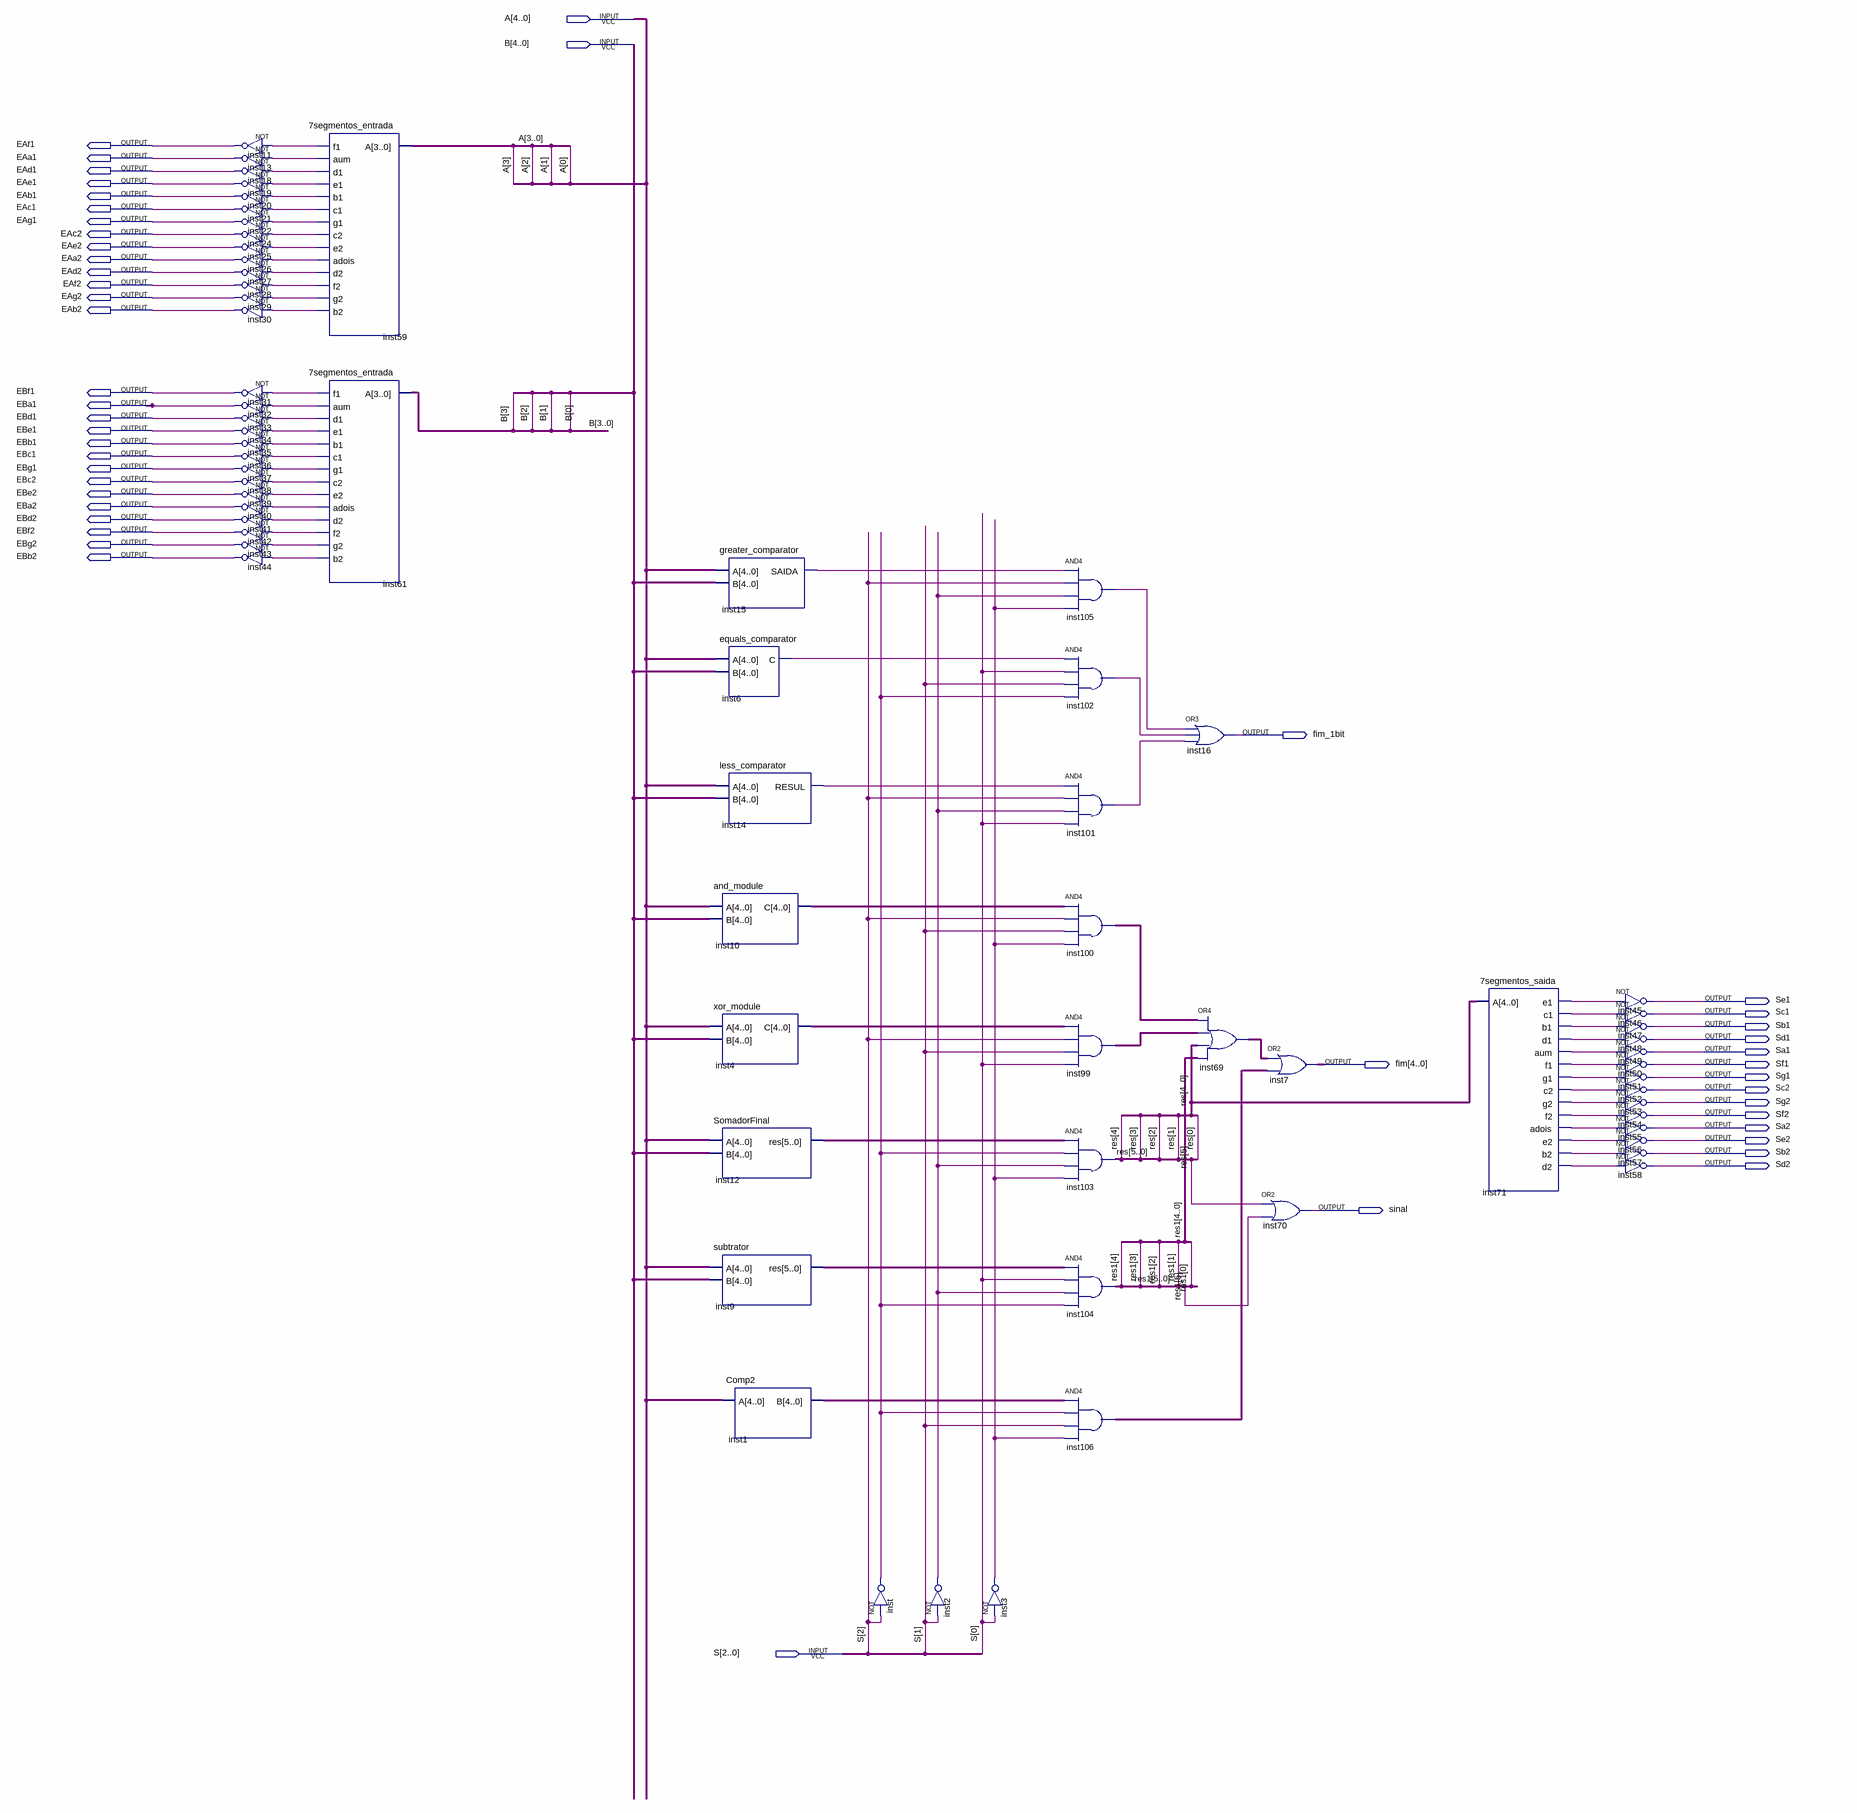
[diagram p0: schematic sheet]
// Quartus schematic projeto_sd.bdf as structural Verilog: 68 symbols, 48 pins
module projeto_sd (
  input  [4:0] A,
  input  [4:0] B,
  input  [2:0] S,
  output EAf1,
  output EAa1,
  output EAd1,
  output EAe1,
  output EAb1,
  output EAc1,
  output EAg1,
  output EAc2,
  output EAe2,
  output EAa2,
  output EAd2,
  output EAf2,
  output EAg2,
  output EAb2,
  output EBf1,
  output EBa1,
  output EBd1,
  output EBe1,
  output EBb1,
  output EBc1,
  output EBg1,
  output EBc2,
  output EBe2,
  output EBa2,
  output EBd2,
  output EBf2,
  output EBg2,
  output EBb2,
  output fim_1bit,
  output Se1,
  output Sc1,
  output Sb1,
  output Sd1,
  output Sa1,
  output [4:0] fim,
  output Sf1,
  output Sg1,
  output Sc2,
  output Sg2,
  output Sf2,
  output Sa2,
  output Se2,
  output Sb2,
  output Sd2,
  output sinal
);

  wire inst2_out, inst3_out, inst6_c, inst14_resul, inst15_saida, inst59_adois, inst59_aum, inst59_b1,
       inst59_b2, inst59_c1, inst59_c2, inst59_d1, inst59_d2, inst59_e1, inst59_e2, inst59_f1, inst59_f2,
       inst59_g1, inst59_g2, inst61_adois, inst61_aum, inst61_b1, inst61_b2, inst61_c1, inst61_c2, inst61_d1,
       inst61_d2, inst61_e1, inst61_e2, inst61_f1, inst61_f2, inst61_g1, inst61_g2, inst71_adois, inst71_aum,
       inst71_b1, inst71_b2, inst71_c1, inst71_c2, inst71_d1, inst71_d2, inst71_e1, inst71_e2, inst71_f1,
       inst71_f2, inst71_g1, inst71_g2, inst101_out, inst102_out, inst105_out, inst_out;
  wire [4:0] inst1_b, inst4_c, inst10_c, inst69_out, inst99_out, inst100_out, inst106_out;
  wire [5:0] inst9_res, inst12_res, res, res1;

  not inst11 (EAf1, inst59_f1);
  not inst13 (EAa1, inst59_aum);
  not inst18 (EAd1, inst59_d1);
  not inst19 (EAe1, inst59_e1);
  not inst20 (EAb1, inst59_b1);
  not inst21 (EAc1, inst59_c1);
  not inst22 (EAg1, inst59_g1);
  not inst24 (EAc2, inst59_c2);
  not inst25 (EAe2, inst59_e2);
  not inst26 (EAa2, inst59_adois);
  not inst27 (EAd2, inst59_d2);
  not inst28 (EAf2, inst59_f2);
  not inst29 (EAg2, inst59_g2);
  not inst30 (EAb2, inst59_b2);
  not inst31 (EBf1, inst61_f1);
  not inst32 (EBa1, inst61_aum);
  not inst33 (EBd1, inst61_d1);
  not inst34 (EBe1, inst61_e1);
  not inst35 (EBb1, inst61_b1);
  not inst36 (EBc1, inst61_c1);
  not inst37 (EBg1, inst61_g1);
  not inst38 (EBc2, inst61_c2);
  not inst39 (EBe2, inst61_e2);
  not inst40 (EBa2, inst61_adois);
  not inst41 (EBd2, inst61_d2);
  not inst42 (EBf2, inst61_f2);
  not inst43 (EBg2, inst61_g2);
  not inst44 (EBb2, inst61_b2);
  \7segmentos_entrada  inst59 (
    .A(A[3:0]), .f1(inst59_f1), .aum(inst59_aum), .d1(inst59_d1), .e1(inst59_e1), .b1(inst59_b1),
    .c1(inst59_c1), .g1(inst59_g1), .c2(inst59_c2), .e2(inst59_e2), .adois(inst59_adois), .d2(inst59_d2),
    .f2(inst59_f2), .g2(inst59_g2), .b2(inst59_b2));
  \7segmentos_entrada  inst61 (
    .A(B[3:0]), .f1(inst61_f1), .aum(inst61_aum), .d1(inst61_d1), .e1(inst61_e1), .b1(inst61_b1),
    .c1(inst61_c1), .g1(inst61_g1), .c2(inst61_c2), .e2(inst61_e2), .adois(inst61_adois), .d2(inst61_d2),
    .f2(inst61_f2), .g2(inst61_g2), .b2(inst61_b2));
  greater_comparator inst15 (.A(A), .B(B), .SAIDA(inst15_saida));
  equals_comparator inst6 (.A(A), .B(B), .C(inst6_c));
  less_comparator inst14 (.A(A), .B(B), .RESUL(inst14_resul));
  and_module inst10 (.A(A), .B(B), .C(inst10_c));
  xor_module inst4 (.A(A), .B(B), .C(inst4_c));
  SomadorFinal inst12 (.A(A), .B(B), .res(inst12_res));
  subtrator inst9 (.A(A), .B(B), .res(inst9_res));
  Comp2 inst1 (.A(A), .B(inst1_b));
  not inst (inst_out, S[2]);
  not inst2 (inst2_out, S[1]);
  not inst3 (inst3_out, S[0]);
  and inst105 (inst105_out, inst15_saida, S[2], inst2_out, inst3_out);
  and inst102 (inst102_out, inst6_c, S[0], S[1], inst_out);
  and inst101 (inst101_out, inst14_resul, S[2], inst2_out, S[0]);
  assign inst100_out = inst10_c & {5{S[2]}} & {5{S[1]}} & {5{inst3_out}};  // AND4 inst100, 5 bits wide
  assign inst99_out = inst4_c & {5{S[2]}} & {5{S[1]}} & {5{S[0]}};  // AND4 inst99, 5 bits wide
  assign res = inst12_res & {6{inst_out}} & {6{inst2_out}} & {6{inst3_out}};  // AND4 inst103, 6 bits wide
  assign res1 = inst9_res & {6{S[0]}} & {6{inst2_out}} & {6{inst_out}};  // AND4 inst104, 6 bits wide
  assign inst106_out = inst1_b & {5{inst_out}} & {5{S[1]}} & {5{inst3_out}};  // AND4 inst106, 5 bits wide
  or inst16 (fim_1bit, inst105_out, inst102_out, inst101_out);
  assign inst69_out = inst100_out | inst99_out | res[4:0] | res1[4:0];  // OR4 inst69, 5 bits wide
  assign fim = inst69_out | inst106_out;  // OR2 inst7, 5 bits wide
  or inst70 (sinal, res[5], res1[5]);
  \7segmentos_saida  inst71 (
    .A(res[4:0]), .e1(inst71_e1), .c1(inst71_c1), .b1(inst71_b1), .d1(inst71_d1), .aum(inst71_aum),
    .f1(inst71_f1), .g1(inst71_g1), .c2(inst71_c2), .g2(inst71_g2), .f2(inst71_f2), .adois(inst71_adois),
    .e2(inst71_e2), .b2(inst71_b2), .d2(inst71_d2));
  not inst45 (Se1, inst71_e1);
  not inst46 (Sc1, inst71_c1);
  not inst47 (Sb1, inst71_b1);
  not inst48 (Sd1, inst71_d1);
  not inst49 (Sa1, inst71_aum);
  not inst50 (Sf1, inst71_f1);
  not inst51 (Sg1, inst71_g1);
  not inst52 (Sc2, inst71_c2);
  not inst53 (Sg2, inst71_g2);
  not inst54 (Sf2, inst71_f2);
  not inst55 (Sa2, inst71_adois);
  not inst56 (Se2, inst71_e2);
  not inst57 (Sb2, inst71_b2);
  not inst58 (Sd2, inst71_d2);
endmodule
